# Altium schematic sheet Power_Official.SchDoc
size A4; Organization: Altium Limited; Address1: L3, 12a Rodborough Rd; Address2: Frenchs Forest; Address3: NSW; Address4: Australia 2086
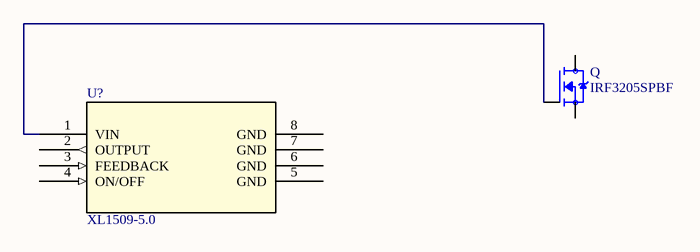
[diagram p0: Power_Official.SchDoc]

## Parts
Q  IRF3205SPBF  [TRANS_IRF3205SPBF]
U?  XL1509-5.0  [SOP8SOIC-8_UMW]

## Nets
NetQ_1: Q.1(G) U?.1(VIN)

Not connected (* = marked no-connect by the designer): Q 2(D) 3(S); U? 2(OUTPUT) 3(FEEDBACK) 4(ON/OFF) 5(GND) 6(GND) 7(GND) 8(GND)

## Notes on the sheet
- Title
- Size:
- Date:
- A4
- Number:
- Time:
- Revision:
- Sheet
- of
- File:

## Library data of the parts
Q = IRF3205SPBF: RoHS Compliant | Low RDS_on_ | Industry-leading quality | Dynamic dv/dt Rating | Fast Switching | Fully Avalanche Rated | 175C Operating Temperature; MF: Infineon Technologies; Package: D2PAK Infineon; Price: None; SnapEDA_Link: https://www.snapeda.com/parts/IRF3205SPBF/Infineon%20Technologies/view-part/576468/?ref=snap; Availability: Unavailable; Value: *; MP: IRF3205SPBF
U? = XL1509-5.0: No Description Available; Mfr_Name: UMW(Youtai Semiconductor Co., Ltd.); RefDes: RefDes; Type: Type